# EAGLE design d200_zm1020_rev_b (EAGLE 6.1)
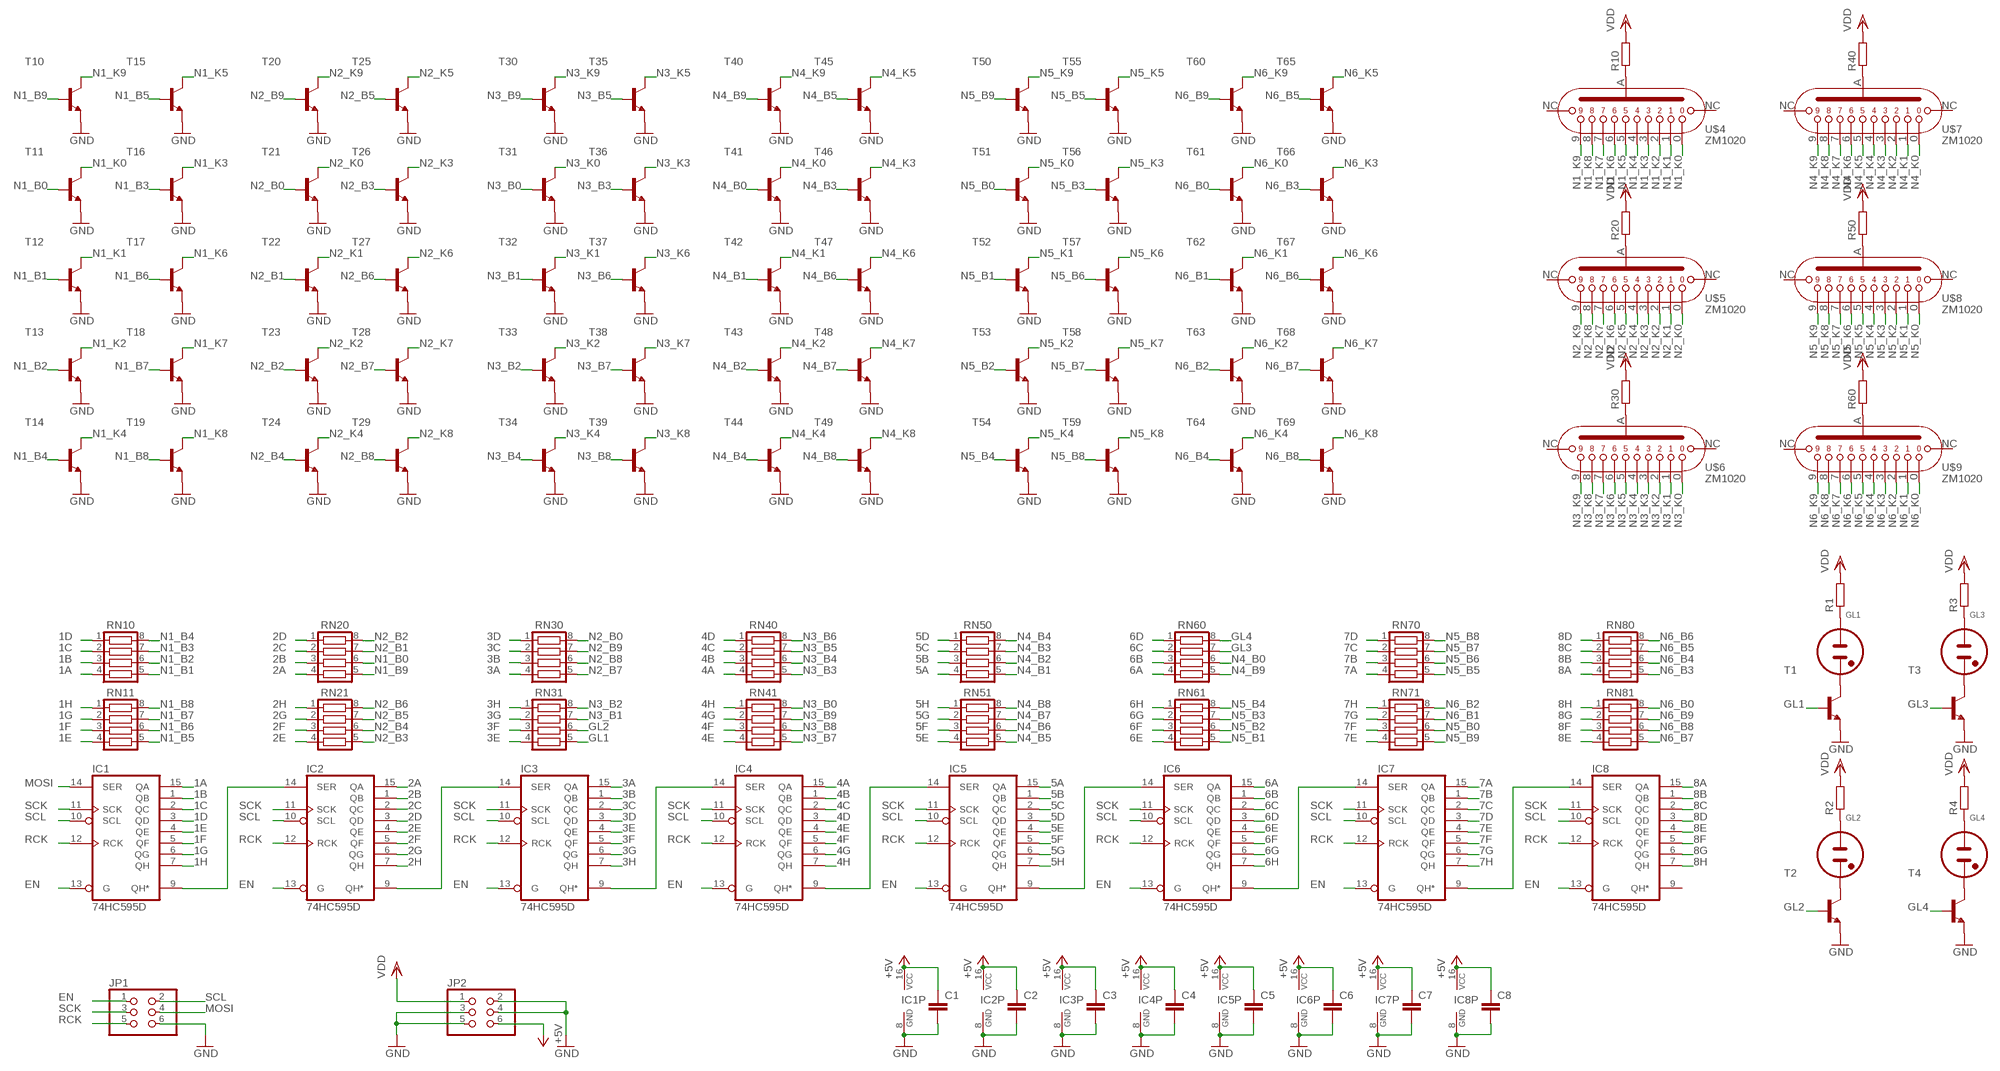
[diagram p0: schematic, sheet 1]

## Parts
C1  C-EUC0603  [C0603]
C2  C-EUC0603  [C0603]
C3  C-EUC0603  [C0603]
C4  C-EUC0603  [C0603]
C5  C-EUC0603  [C0603]
C6  C-EUC0603  [C0603]
C7  C-EUC0603  [C0603]
C8  C-EUC0603  [C0603]
GL1  NE2-NEON-BULB-DRILL  [NE2-NEON-BULB-DRILL]
GL2  NE2-NEON-BULB-DRILL  [NE2-NEON-BULB-DRILL]
GL3  NE2-NEON-BULB-DRILL  [NE2-NEON-BULB-DRILL]
GL4  NE2-NEON-BULB-DRILL  [NE2-NEON-BULB-DRILL]
IC1  74HC595D  [SO16]
IC2  74HC595D  [SO16]
IC3  74HC595D  [SO16]
IC4  74HC595D  [SO16]
IC5  74HC595D  [SO16]
IC6  74HC595D  [SO16]
IC7  74HC595D  [SO16]
IC8  74HC595D  [SO16]
JP1  PINHD-2X3_2.54-SMD  [2X03SMD]
JP2  PINHD-2X3_2.54-SMD  [2X03SMD]
R1  R-EU_R0603  [R0603]
R2  R-EU_R0603  [R0603]
R3  R-EU_R0603  [R0603]
R4  R-EU_R0603  [R0603]
R10  R-EU_R0603  [R0603]
R20  R-EU_R0603  [R0603]
R30  R-EU_R0603  [R0603]
R40  R-EU_R0603  [R0603]
R50  R-EU_R0603  [R0603]
R60  R-EU_R0603  [R0603]
RN10  CTS742C083  [CTS742C083]
RN11  CTS742C083  [CTS742C083]
RN20  CTS742C083  [CTS742C083]
RN21  CTS742C083  [CTS742C083]
RN30  CTS742C083  [CTS742C083]
RN31  CTS742C083  [CTS742C083]
RN40  CTS742C083  [CTS742C083]
RN41  CTS742C083  [CTS742C083]
RN50  CTS742C083  [CTS742C083]
RN51  CTS742C083  [CTS742C083]
RN60  CTS742C083  [CTS742C083]
RN61  CTS742C083  [CTS742C083]
RN70  CTS742C083  [CTS742C083]
RN71  CTS742C083  [CTS742C083]
RN80  CTS742C083  [CTS742C083]
RN81  CTS742C083  [CTS742C083]
T1  SMBTA42  [SOT23]
T2  SMBTA42  [SOT23]
T3  SMBTA42  [SOT23]
T4  SMBTA42  [SOT23]
T10  SMBTA42  [SOT23]
T11  SMBTA42  [SOT23]
T12  SMBTA42  [SOT23]
T13  SMBTA42  [SOT23]
T14  SMBTA42  [SOT23]
T15  SMBTA42  [SOT23]
T16  SMBTA42  [SOT23]
T17  SMBTA42  [SOT23]
T18  SMBTA42  [SOT23]
T19  SMBTA42  [SOT23]
T20  SMBTA42  [SOT23]
T21  SMBTA42  [SOT23]
T22  SMBTA42  [SOT23]
T23  SMBTA42  [SOT23]
T24  SMBTA42  [SOT23]
T25  SMBTA42  [SOT23]
T26  SMBTA42  [SOT23]
T27  SMBTA42  [SOT23]
T28  SMBTA42  [SOT23]
T29  SMBTA42  [SOT23]
T30  SMBTA42  [SOT23]
T31  SMBTA42  [SOT23]
T32  SMBTA42  [SOT23]
T33  SMBTA42  [SOT23]
T34  SMBTA42  [SOT23]
T35  SMBTA42  [SOT23]
T36  SMBTA42  [SOT23]
T37  SMBTA42  [SOT23]
T38  SMBTA42  [SOT23]
T39  SMBTA42  [SOT23]
T40  SMBTA42  [SOT23]
T41  SMBTA42  [SOT23]
T42  SMBTA42  [SOT23]
T43  SMBTA42  [SOT23]
T44  SMBTA42  [SOT23]
T45  SMBTA42  [SOT23]
T46  SMBTA42  [SOT23]
T47  SMBTA42  [SOT23]
T48  SMBTA42  [SOT23]
T49  SMBTA42  [SOT23]
T50  SMBTA42  [SOT23]
T51  SMBTA42  [SOT23]
T52  SMBTA42  [SOT23]
T53  SMBTA42  [SOT23]
T54  SMBTA42  [SOT23]
T55  SMBTA42  [SOT23]
T56  SMBTA42  [SOT23]
T57  SMBTA42  [SOT23]
T58  SMBTA42  [SOT23]
T59  SMBTA42  [SOT23]
T60  SMBTA42  [SOT23]
T61  SMBTA42  [SOT23]
T62  SMBTA42  [SOT23]
T63  SMBTA42  [SOT23]
T64  SMBTA42  [SOT23]
T65  SMBTA42  [SOT23]
T66  SMBTA42  [SOT23]
T67  SMBTA42  [SOT23]
T68  SMBTA42  [SOT23]
T69  SMBTA42  [SOT23]
U$4  ZM1020  [ZM1020]
U$5  ZM1020  [ZM1020]
U$6  ZM1020  [ZM1020]
U$7  ZM1020  [ZM1020]
U$8  ZM1020  [ZM1020]
U$9  ZM1020  [ZM1020]

## Nets
1A: IC1.15(QA) RN10.4
1B: IC1.1(QB) RN10.3
1C: IC1.2(QC) RN10.2
1D: IC1.3(QD) RN10.1
1E: IC1.4(QE) RN11.4
1F: IC1.5(QF) RN11.3
1G: IC1.6(QG) RN11.2
1H: IC1.7(QH) RN11.1
2A: IC2.15(QA) RN20.4
2B: IC2.1(QB) RN20.3
2C: IC2.2(QC) RN20.2
2D: IC2.3(QD) RN20.1
2E: IC2.4(QE) RN21.4
2F: IC2.5(QF) RN21.3
2G: IC2.6(QG) RN21.2
2H: IC2.7(QH) RN21.1
3A: IC3.15(QA) RN30.4
3B: IC3.1(QB) RN30.3
3C: IC3.2(QC) RN30.2
3D: IC3.3(QD) RN30.1
3E: IC3.4(QE) RN31.4
3F: IC3.5(QF) RN31.3
3G: IC3.6(QG) RN31.2
3H: IC3.7(QH) RN31.1
4A: IC4.15(QA) RN40.4
4B: IC4.1(QB) RN40.3
4C: IC4.2(QC) RN40.2
4D: IC4.3(QD) RN40.1
4E: IC4.4(QE) RN41.4
4F: IC4.5(QF) RN41.3
4G: IC4.6(QG) RN41.2
4H: IC4.7(QH) RN41.1
5A: IC5.15(QA) RN50.4
5B: IC5.1(QB) RN50.3
5C: IC5.2(QC) RN50.2
5D: IC5.3(QD) RN50.1
5E: IC5.4(QE) RN51.4
5F: IC5.5(QF) RN51.3
5G: IC5.6(QG) RN51.2
5H: IC5.7(QH) RN51.1
6A: IC6.15(QA) RN60.4
6B: IC6.1(QB) RN60.3
6C: IC6.2(QC) RN60.2
6D: IC6.3(QD) RN60.1
6E: IC6.4(QE) RN61.4
6F: IC6.5(QF) RN61.3
6G: IC6.6(QG) RN61.2
6H: IC6.7(QH) RN61.1
7A: IC7.15(QA) RN70.4
7B: IC7.1(QB) RN70.3
7C: IC7.2(QC) RN70.2
7D: IC7.3(QD) RN70.1
7E: IC7.4(QE) RN71.4
7F: IC7.5(QF) RN71.3
7G: IC7.6(QG) RN71.2
7H: IC7.7(QH) RN71.1
8A: IC8.15(QA) RN80.4
8B: IC8.1(QB) RN80.3
8C: IC8.2(QC) RN80.2
8D: IC8.3(QD) RN80.1
8E: IC8.4(QE) RN81.4
8F: IC8.5(QF) RN81.3
8G: IC8.6(QG) RN81.2
8H: IC8.7(QH) RN81.1
+5V: C1.1 C2.1 C3.1 C4.1 C5.1 C6.1 C7.1 C8.1 IC1.16(VCC) IC2.16(VCC) IC3.16(VCC) IC4.16(VCC) IC5.16(VCC) IC6.16(VCC) IC7.16(VCC) IC8.16(VCC) JP2.6
EN: IC1.13(G) IC2.13(G) IC3.13(G) IC4.13(G) IC5.13(G) IC6.13(G) IC7.13(G) IC8.13(G) JP1.1
GL1: RN31.5 T1.1(B)
GL2: RN31.6 T2.1(B)
GL3: RN60.7 T3.1(B)
GL4: RN60.8 T4.1(B)
GND: C1.2 C2.2 C3.2 C4.2 C5.2 C6.2 C7.2 C8.2 IC1.8(GND) IC2.8(GND) IC3.8(GND) IC4.8(GND) IC5.8(GND) IC6.8(GND) IC7.8(GND) IC8.8(GND) JP1.6 JP2.2 JP2.3 JP2.4 JP2.5 T1.2(E) T2.2(E) T3.2(E) T4.2(E) T10.2(E) T11.2(E) T12.2(E) T13.2(E) T14.2(E) T15.2(E) T16.2(E) T17.2(E) T18.2(E) T19.2(E) T20.2(E) T21.2(E) T22.2(E) T23.2(E) T24.2(E) T25.2(E) T26.2(E) T27.2(E) T28.2(E) T29.2(E) T30.2(E) T31.2(E) T32.2(E) T33.2(E) T34.2(E) T35.2(E) T36.2(E) T37.2(E) T38.2(E) T39.2(E) T40.2(E) T41.2(E) T42.2(E) T43.2(E) T44.2(E) T45.2(E) T46.2(E) T47.2(E) T48.2(E) T49.2(E) T50.2(E) T51.2(E) T52.2(E) T53.2(E) T54.2(E) T55.2(E) T56.2(E) T57.2(E) T58.2(E) T59.2(E) T60.2(E) T61.2(E) T62.2(E) T63.2(E) T64.2(E) T65.2(E) T66.2(E) T67.2(E) T68.2(E) T69.2(E)
MOSI: IC1.14(SER) JP1.4
N1_B0: RN20.6 T11.1(B)
N1_B1: RN10.5 T12.1(B)
N1_B2: RN10.6 T13.1(B)
N1_B3: RN10.7 T16.1(B)
N1_B4: RN10.8 T14.1(B)
N1_B5: RN11.5 T15.1(B)
N1_B6: RN11.6 T17.1(B)
N1_B7: RN11.7 T18.1(B)
N1_B8: RN11.8 T19.1(B)
N1_B9: RN20.5 T10.1(B)
N1_K0: T11.3(C) U$4.P3
N1_K1: T12.3(C) U$4.P13
N1_K2: T13.3(C) U$4.P12
N1_K3: T16.3(C) U$4.P11
N1_K4: T14.3(C) U$4.P10
N1_K5: T15.3(C) U$4.P9
N1_K6: T17.3(C) U$4.P7
N1_K7: T18.3(C) U$4.P6
N1_K8: T19.3(C) U$4.P5
N1_K9: T10.3(C) U$4.P4
N2_B0: RN30.8 T21.1(B)
N2_B1: RN20.7 T22.1(B)
N2_B2: RN20.8 T23.1(B)
N2_B3: RN21.5 T26.1(B)
N2_B4: RN21.6 T24.1(B)
N2_B5: RN21.7 T25.1(B)
N2_B6: RN21.8 T27.1(B)
N2_B7: RN30.5 T28.1(B)
N2_B8: RN30.6 T29.1(B)
N2_B9: RN30.7 T20.1(B)
N2_K0: T21.3(C) U$5.P3
N2_K1: T22.3(C) U$5.P13
N2_K2: T23.3(C) U$5.P12
N2_K3: T26.3(C) U$5.P11
N2_K4: T24.3(C) U$5.P10
N2_K5: T25.3(C) U$5.P9
N2_K6: T27.3(C) U$5.P7
N2_K7: T28.3(C) U$5.P6
N2_K8: T29.3(C) U$5.P5
N2_K9: T20.3(C) U$5.P4
N3_B0: RN41.8 T31.1(B)
N3_B1: RN31.7 T32.1(B)
N3_B2: RN31.8 T33.1(B)
N3_B3: RN40.5 T36.1(B)
N3_B4: RN40.6 T34.1(B)
N3_B5: RN40.7 T35.1(B)
N3_B6: RN40.8 T37.1(B)
N3_B7: RN41.5 T38.1(B)
N3_B8: RN41.6 T39.1(B)
N3_B9: RN41.7 T30.1(B)
N3_K0: T31.3(C) U$6.P3
N3_K1: T32.3(C) U$6.P13
N3_K2: T33.3(C) U$6.P12
N3_K3: T36.3(C) U$6.P11
N3_K4: T34.3(C) U$6.P10
N3_K5: T35.3(C) U$6.P9
N3_K6: T37.3(C) U$6.P7
N3_K7: T38.3(C) U$6.P6
N3_K8: T39.3(C) U$6.P5
N3_K9: T30.3(C) U$6.P4
N4_B0: RN60.6 T41.1(B)
N4_B1: RN50.5 T42.1(B)
N4_B2: RN50.6 T43.1(B)
N4_B3: RN50.7 T46.1(B)
N4_B4: RN50.8 T44.1(B)
N4_B5: RN51.5 T45.1(B)
N4_B6: RN51.6 T47.1(B)
N4_B7: RN51.7 T48.1(B)
N4_B8: RN51.8 T49.1(B)
N4_B9: RN60.5 T40.1(B)
N4_K0: T41.3(C) U$7.P3
N4_K1: T42.3(C) U$7.P13
N4_K2: T43.3(C) U$7.P12
N4_K3: T46.3(C) U$7.P11
N4_K4: T44.3(C) U$7.P10
N4_K5: T45.3(C) U$7.P9
N4_K6: T47.3(C) U$7.P7
N4_K7: T48.3(C) U$7.P6
N4_K8: T49.3(C) U$7.P5
N4_K9: T40.3(C) U$7.P4
N5_B0: RN71.6 T51.1(B)
N5_B1: RN61.5 T52.1(B)
N5_B2: RN61.6 T53.1(B)
N5_B3: RN61.7 T56.1(B)
N5_B4: RN61.8 T54.1(B)
N5_B5: RN70.5 T55.1(B)
N5_B6: RN70.6 T57.1(B)
N5_B7: RN70.7 T58.1(B)
N5_B8: RN70.8 T59.1(B)
N5_B9: RN71.5 T50.1(B)
N5_K0: T51.3(C) U$8.P3
N5_K1: T52.3(C) U$8.P13
N5_K2: T53.3(C) U$8.P12
N5_K3: T56.3(C) U$8.P11
N5_K4: T54.3(C) U$8.P10
N5_K5: T55.3(C) U$8.P9
N5_K6: T57.3(C) U$8.P7
N5_K7: T58.3(C) U$8.P6
N5_K8: T59.3(C) U$8.P5
N5_K9: T50.3(C) U$8.P4
N6_B0: RN81.8 T61.1(B)
N6_B1: RN71.7 T62.1(B)
N6_B2: RN71.8 T63.1(B)
N6_B3: RN80.5 T66.1(B)
N6_B4: RN80.6 T64.1(B)
N6_B5: RN80.7 T65.1(B)
N6_B6: RN80.8 T67.1(B)
N6_B7: RN81.5 T68.1(B)
N6_B8: RN81.6 T69.1(B)
N6_B9: RN81.7 T60.1(B)
N6_K0: T61.3(C) U$9.P3
N6_K1: T62.3(C) U$9.P13
N6_K2: T63.3(C) U$9.P12
N6_K3: T66.3(C) U$9.P11
N6_K4: T64.3(C) U$9.P10
N6_K5: T65.3(C) U$9.P9
N6_K6: T67.3(C) U$9.P7
N6_K7: T68.3(C) U$9.P6
N6_K8: T69.3(C) U$9.P5
N6_K9: T60.3(C) U$9.P4
N$1: GL2.1(A) R2.1
N$2: GL3.1(A) R3.1
N$3: GL4.1(A) R4.1
N$4: R10.1 U$4.P2(A)
N$5: GL2.2(A1) T2.3(C)
N$6: GL1.2(A1) T1.3(C)
N$7: GL4.2(A1) T4.3(C)
N$8: GL3.2(A1) T3.3(C)
N$9: R20.1 U$5.P2(A)
N$10: IC1.9(QH*) IC2.14(SER)
N$11: IC2.9(QH*) IC3.14(SER)
N$12: IC3.9(QH*) IC4.14(SER)
N$13: R30.1 U$6.P2(A)
N$14: R40.1 U$7.P2(A)
N$15: R50.1 U$8.P2(A)
N$16: IC4.9(QH*) IC5.14(SER)
N$17: R60.1 U$9.P2(A)
N$18: IC5.9(QH*) IC6.14(SER)
N$19: IC6.9(QH*) IC7.14(SER)
N$20: IC7.9(QH*) IC8.14(SER)
N$21: GL1.1(A) R1.1
RCK: IC1.12(RCK) IC2.12(RCK) IC3.12(RCK) IC4.12(RCK) IC5.12(RCK) IC6.12(RCK) IC7.12(RCK) IC8.12(RCK) JP1.5
SCK: IC1.11(SCK) IC2.11(SCK) IC3.11(SCK) IC4.11(SCK) IC5.11(SCK) IC6.11(SCK) IC7.11(SCK) IC8.11(SCK) JP1.3
SCL: IC1.10(SCL) IC2.10(SCL) IC3.10(SCL) IC4.10(SCL) IC5.10(SCL) IC6.10(SCL) IC7.10(SCL) IC8.10(SCL) JP1.2
VDD: JP2.1 R1.2 R2.2 R3.2 R4.2 R10.2 R20.2 R30.2 R40.2 R50.2 R60.2
Unconnected: IC8.9(QH*) U$4.P1(NC1) U$4.P8(NC2) U$5.P1(NC1) U$5.P8(NC2) U$6.P1(NC1) U$6.P8(NC2) U$7.P1(NC1) U$7.P8(NC2) U$8.P1(NC1) U$8.P8(NC2) U$9.P1(NC1) U$9.P8(NC2)

## Library data of the parts
C1-C8 = rcl:C-EU: CAPACITOR, European symbol
GL1-GL4 = nixie_tube:NE2-NEON-BULB: Neon indicator (wire connection)
IC1-IC8 = 74xx-eu:74*595: 8-bit SHIFT REGISTER, output latch
JP1 JP2 = con-pinhead:PINHD-2X3: PIN HEADER
R1-R4 R10 R20 R30 R40 R50 R60 = rcl:R-EU_: RESISTOR, European symbol
RN10 RN11 RN20 RN21 RN30 RN31 RN40 RN41 RN50 RN51 RN60 RN61 RN70 RN71 RN80 RN81 = resistor-net:CTS742C083: Chip Resistor Array 4 Single Resistor Source: http://www.ctscorp.com/components/Datasheets/CTSChipArrayDs.pdf; OC_FARNELL: unknown; OC_NEWARK: unknown
T1-T4 T10-T69 = transistor-hv:SMBTA42
U$4-U$9 = nixietubes-western:ZM1020

## Board
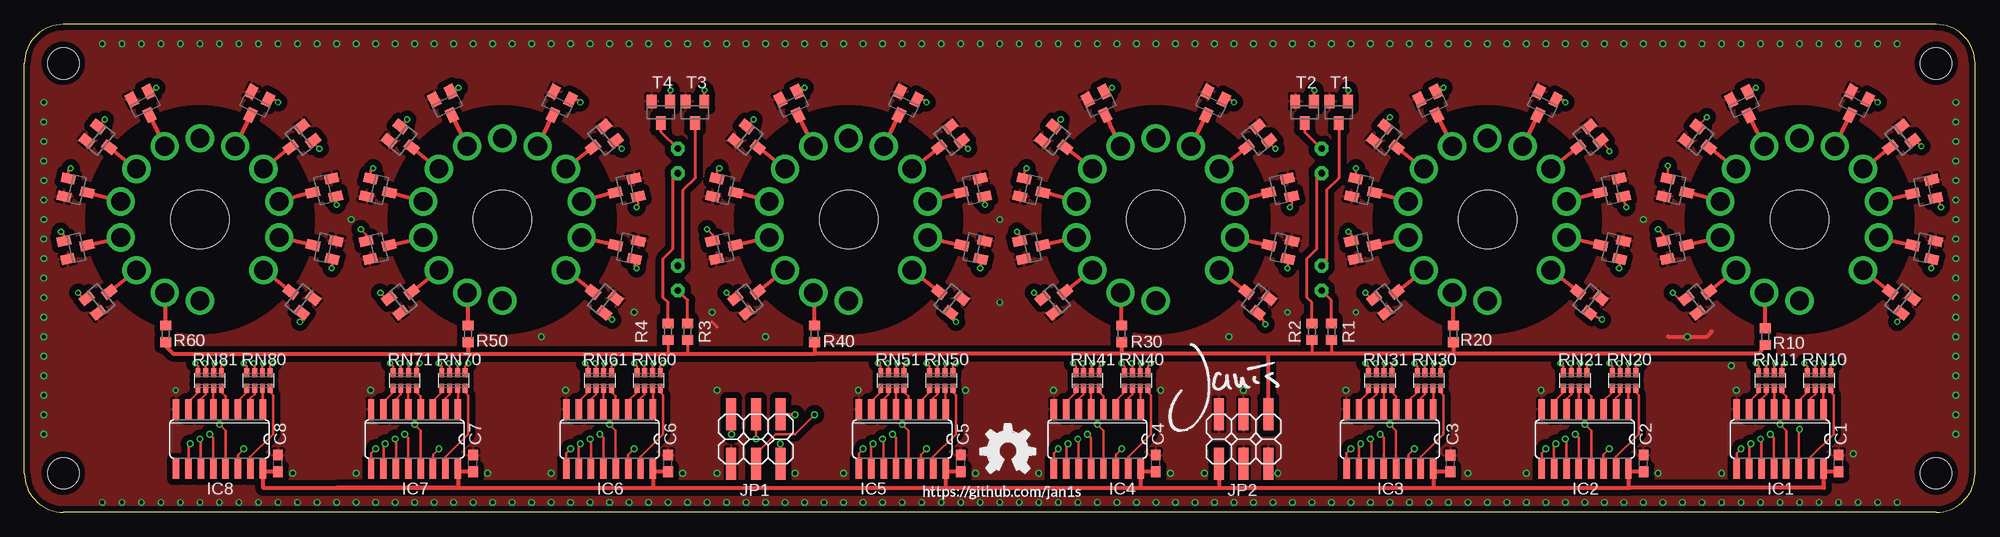
[diagram p1: board, top side]
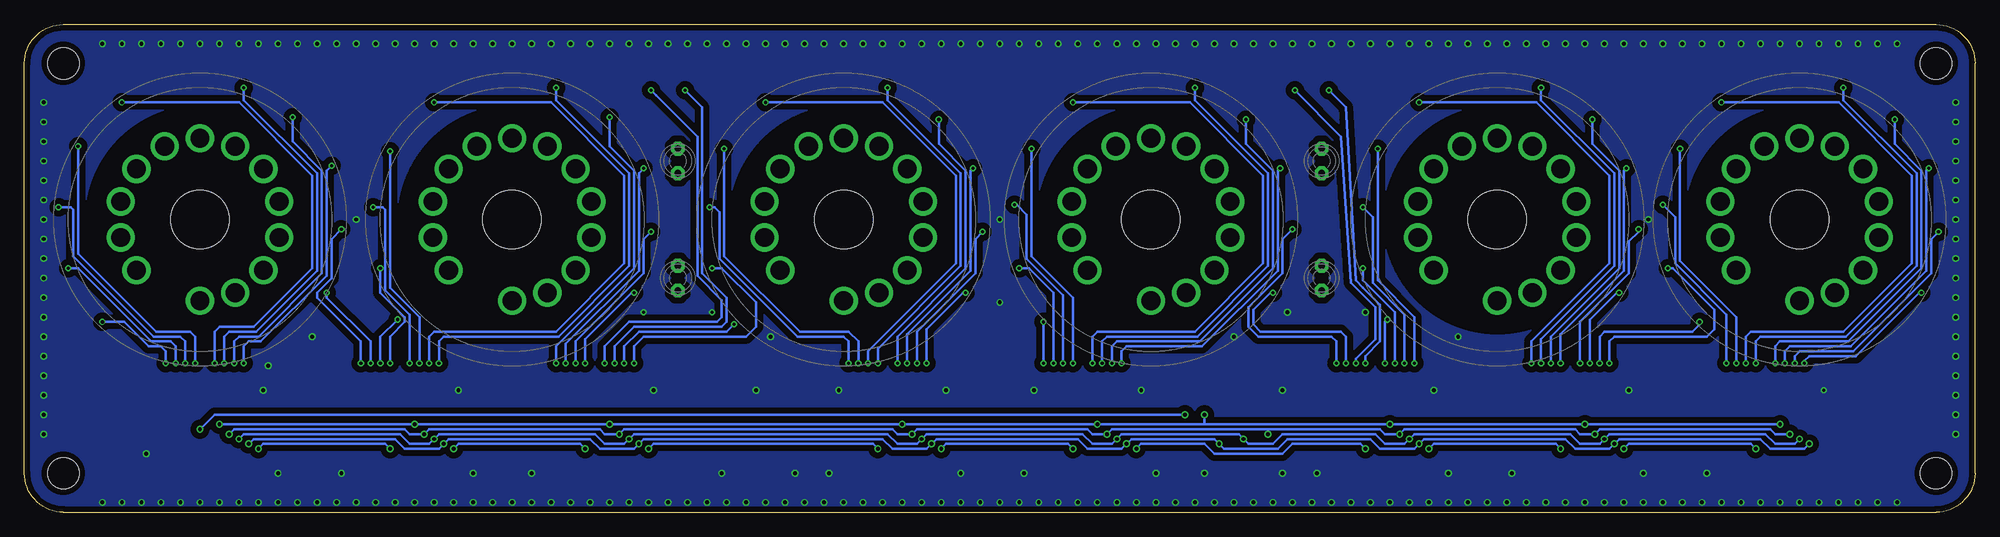
[diagram p2: board, bottom side, seen from below]

Size 200 x 50 mm. Coordinates in mm from the lower left corner, seen from the top.
Outline: 196,0 4,0 arc-90 0,4 0,46 arc-90 4,50 196,50 arc-90 200,46 200,4 arc-90 196,0
Copper layers (1*16): Top 0.035mm / dielectric 1.5mm / Bottom 0.035mm
Design rules: minimum track width 6mil, minimum drill 12mil, track to track 6mil, track to pad 6mil, pad to pad 6mil, via to via 6mil, smd to smd 0mil, copper to edge 10mil, drill to drill 10mil, minimum pad ring 10mil, minimum via ring 6mil, stop-mask expansion 2mil, vias tented up to drill 100mil, thermal gap 10mil
Holes 3.2 mm at 196,4 196,46 4,46 4,4
tRestrict: area 171,19 to 193,41; area 139,19 to 161,41; area 105,19 to 127,41; area 73.5,19 to 95.5,41; area 38,19 to 60,41; area 7,19 to 29,41
bRestrict: area 171,19 to 193,41; area 139,19 to 161,41; area 105,19 to 127,41; area 73.5,19 to 95.5,41; area 38,19 to 60,41; area 7,19 to 29,41

### Footprints (pad centres in the part's own frame; a part is rotated, then mirrored left to right if it is on the bottom)
C0603 = smd 1.1 x 1: 1 -0.85,0; 2 0.85,0
NE2-NEON-BULB-DRILL = drill 0.7 pad 1.422 octagon: 1 0,1.27; 2 0,-1.27
SO16 = smd 0.66 x 2.032: 1 -4.445,-3.073; 2 -3.175,-3.073; 3 -1.905,-3.073; 4 -0.635,-3.073; 5 0.635,-3.073; 6 1.905,-3.073; 7 3.175,-3.073; 8 4.445,-3.073; 9 4.445,3.073; 10 3.175,3.073; 11 1.905,3.073; 12 0.635,3.073; 13 -0.635,3.073; 14 -1.905,3.073; 15 -3.175,3.073; 16 -4.445,3.073
2X03SMD = smd 1.016 x 3.302: 1 -2.54,-2.54; 2 -2.54,2.54; 3 0,-2.54; 4 0,2.54; 5 2.54,-2.54; 6 2.54,2.54
R0603 = smd 1 x 1.1: 1 -0.85,0; 2 0.85,0
CTS742C083 = smd 0.5 x 0.9: 1 -1.2,-0.8; 2 -0.4,-0.8; 3 0.4,-0.8; 4 1.2,-0.8; 5 1.2,0.8; 6 0.4,0.8; 7 -0.4,0.8; 8 -1.2,0.8
SOT23 = smd 1 x 1.4: 1 -0.95,-1.1; 2 0.95,-1.1; 3 0,1.1
ZM1020 = drill 1.93: P1 0,-8.325; P2 3.61,-7.5; P3 6.51,-5.19; P4 8.12,-1.85; P5 8.12,1.85; P6 6.51,5.19; P7 3.61,7.5; P8 0,8.325; P9 -3.61,7.5; P10 -6.51,5.19; P11 -8.12,1.85; P12 -8.12,-1.85; P13 -6.51,-5.19 | hole 6: 0,0

### Placement (x,y rotation side)
C1  186,5 90 top
C2  166,5 90 top
C3  146.2,4.99 90 top
C4  116,5 90 top
C5  96,5 90 top
C6  66,5 90 top
C7  46,5 90 top
C8  26,5 90 top
GL1  133,24 180 bottom
GL2  133,36 180 bottom
GL3  67,24 180 bottom
GL4  67,36 180 bottom
IC1  180,7.5 180 top
IC2  160,7.5 180 top
IC3  140,7.5 180 top
IC4  110,7.5 180 top
IC5  90,7.5 180 top
IC6  60,7.5 180 top
IC7  40,7.5 180 top
IC8  20,7.5 180 top
JP1  75,7.5 180 top
JP2  125,7.5 180 top
R1  134,18.5 270 top
R2  132,18.5 270 top
R3  68,18.5 270 top
R4  66,18.5 270 top
R10  178.5,18 270 top
R20  146.5,18.28 270 top
R30  112.5,18.28 270 top
R40  81,18.28 270 top
R50  45.5,18.28 270 top
R60  14.5,18.28 270 top
RN10  184,13.5 0 top
RN11  179,13.5 0 top
RN20  164,13.5 0 top
RN21  159,13.5 0 top
RN30  144,13.5 0 top
RN31  139,13.5 0 top
RN40  114,13.5 0 top
RN41  109,13.5 0 top
RN50  94,13.5 0 top
RN51  89,13.5 0 top
RN60  64,13.5 0 top
RN61  59,13.5 0 top
RN70  44,13.5 0 top
RN71  39,13.5 0 top
RN80  24,13.5 0 top
RN81  19,13.5 0 top
T1  134.75,41 180 top
T2  131.25,41 180 top
T3  68.75,41 180 top
T4  65.25,41 180 top
T10  169.32,27.12 282.8 top
T11  171.84,21.89 308.6 top
T12  192.16,21.89 51.4 top
T13  194.68,27.12 77.2 top
T14  192.16,38.11 128.6 top
T15  187.66,41.7 154.2 top
T16  194.67,32.9 102.9 top
T17  176.32,41.66 205.8 top
T18  171.83,38.1 231.4 top
T19  169.36,33.03 256.5 top
T20  137.32,27.12 282.8 top
T21  139.84,21.89 308.6 top
T22  160.16,21.89 51.4 top
T23  162.68,27.12 77.2 top
T24  160.16,38.11 128.6 top
T25  155.66,41.7 154.2 top
T26  162.64,33.03 103.5 top
T27  144.34,41.7 205.8 top
T28  139.84,38.11 231.4 top
T29  137.36,33.03 256.5 top
T30  103.32,27.12 282.8 top
T31  105.84,21.89 308.6 top
T32  126.16,21.89 51.4 top
T33  128.68,27.12 77.2 top
T34  126.16,38.11 128.6 top
T35  121.66,41.7 154.2 top
T36  128.64,33.03 103.5 top
T37  110.34,41.7 205.8 top
T38  105.84,38.11 231.4 top
T39  103.36,33.03 256.5 top
T40  71.82,27.12 282.8 top
T41  74.34,21.89 308.6 top
T42  94.66,21.89 51.4 top
T43  97.18,27.12 77.2 top
T44  94.66,38.11 128.6 top
T45  90.16,41.7 154.2 top
T46  97.14,33.03 103.5 top
T47  78.84,41.7 205.8 top
T48  74.34,38.11 231.4 top
T49  71.86,33.03 256.5 top
T50  36.32,27.12 282.8 top
T51  38.84,21.89 308.6 top
T52  59.16,21.89 51.4 top
T53  61.68,27.12 77.2 top
T54  59.16,38.11 128.6 top
T55  54.66,41.7 154.2 top
T56  61.64,33.03 103.5 top
T57  43.34,41.7 205.8 top
T58  38.84,38.11 231.4 top
T59  36.36,33.03 256.5 top
T60  5.32,27.12 282.8 top
T61  7.84,21.89 308.6 top
T62  28.16,21.89 51.4 top
T63  30.68,27.12 77.2 top
T64  28.16,38.11 128.6 top
T65  23.66,41.7 154.2 top
T66  30.64,33.03 103.5 top
T67  12.34,41.7 205.8 top
T68  7.84,38.11 231.4 top
T69  5.36,33.03 256.5 top
U$1  [OSHW_FILLX200_NOTEXT]  98,4 0 top
U$2  [JANIS_10MM]  117,8 0 top
U$3  [GITHUB/JAN1S]  92,1.5 0 top
U$4  182,30 0 bottom
U$5  150,30 0 bottom
U$6  116,30 0 bottom
U$7  84.5,30 0 bottom
U$8  49,30 0 bottom
U$9  18,30 0 bottom

### Tracks (layer width: path | path; a pad name or v marks a point on that pad's centre or on a via)
1A
  Top 0.254: RN10.4 185.2,12.3 185.5,12 185.5,8 183.18,5.67 IC1.15
1B
  Top 0.254: IC1.1 184.44,12.65 RN10.3
1C
  Top 0.254: RN10.2 183.6,12.1 183.18,11.68 IC1.2
1D
  Top 0.254: RN10.1 182.8,12.3 181.91,11.4 IC1.3
1E
  Top 0.254: RN11.4 180.2,12.3 180.63,11.87 IC1.4
1F
  Top 0.254: RN11.3 179.4,10.61 IC1.5
1G
  Top 0.254: RN11.2 178.6,12.1 178.09,11.6 IC1.6
1H
  Top 0.254: RN11.1 177.8,12.3 176.82,11.32 IC1.7
2A
  Top 0.254: RN20.4 165.2,12.3 165.5,12 165.5,8 163.18,5.67 IC2.15
2B
  Top 0.254: IC2.1 164.44,12.65 RN20.3
2C
  Top 0.254: RN20.2 163.6,12.1 163.18,11.68 IC2.2
2D
  Top 0.254: RN20.1 162.8,12.3 161.91,11.4 IC2.3
2E
  Top 0.254: RN21.4 160.2,12.3 160.63,11.87 IC2.4
2F
  Top 0.254: IC2.5 159.37,12.66 RN21.3
2G
  Top 0.254: RN21.2 158.6,12.1 158.09,11.6 IC2.6
2H
  Top 0.254: RN21.1 157.8,12.3 156.82,11.32 IC2.7
3A
  Top 0.254: RN30.4 145.2,12.3 145.5,12 145.5,8 143.18,5.67 IC3.15
3B
  Top 0.254: IC3.1 144.44,12.65 RN30.3
3C
  Top 0.254: RN30.2 143.6,12.1 143.18,11.68 IC3.2
3D
  Top 0.254: RN30.1 142.8,12.3 141.91,11.4 IC3.3
3E
  Top 0.254: RN31.4 140.2,12.3 140.63,11.87 IC3.4
3F
  Top 0.254: IC3.5 139.37,12.66 RN31.3
3G
  Top 0.254: IC3.6 138.09,11.6 138.6,12.1 RN31.2
3H
  Top 0.254: IC3.7 136.82,11.32 137.8,12.3 RN31.1
4A
  Top 0.254: RN40.4 115.2,12.3 115.5,12 115.5,8 113.17,5.67 IC4.15
4B
  Top 0.254: IC4.1 114.44,12.65 RN40.3
4C
  Top 0.254: RN40.2 113.6,12.1 113.17,11.68 IC4.2
4D
  Top 0.254: RN40.1 112.8,12.3 111.91,11.4 IC4.3
4E
  Top 0.254: RN41.4 110.2,12.3 110.64,11.87 IC4.4
4F
  Top 0.254: IC4.5 109.36,12.66 RN41.3
4G
  Top 0.254: IC4.6 108.09,11.6 108.6,12.1 RN41.2
4H
  Top 0.254: RN41.1 107.8,12.3 106.83,11.32 IC4.7
5A
  Top 0.254: RN50.4 95.2,12.3 95.5,12 95.5,8 93.17,5.67 IC5.15
5B
  Top 0.254: IC5.1 94.44,12.65 RN50.3
5C
  Top 0.254: IC5.2 93.17,11.68 93.6,12.1 RN50.2
5D
  Top 0.254: RN50.1 92.8,12.3 91.91,11.4 IC5.3
5E
  Top 0.254: RN51.4 90.2,12.3 90.64,11.87 IC5.4
5F
  Top 0.254: IC5.5 89.36,12.66 RN51.3
5G
  Top 0.254: IC5.6 88.09,11.6 88.6,12.1 RN51.2
5H
  Top 0.254: RN51.1 87.8,12.3 86.83,11.32 IC5.7
6A
  Top 0.254: RN60.4 65.2,12.3 65.5,12 65.5,8 63.17,5.67 IC6.15
6B
  Top 0.254: IC6.1 64.44,12.65 RN60.3
6C
  Top 0.254: IC6.2 63.17,11.68 63.6,12.1 RN60.2
6D
  Top 0.254: IC6.3 61.91,11.4 62.8,12.3 RN60.1
6E
  Top 0.254: IC6.4 60.63,11.87 60.2,12.3 RN61.4
6F
  Top 0.254: IC6.5 59.37,12.66 RN61.3
6G
  Top 0.254: IC6.6 58.09,11.6 58.6,12.1 RN61.2
6H
  Top 0.254: IC6.7 56.83,11.32 57.8,12.3 RN61.1
7A
  Top 0.254: RN70.4 45.2,12.3 45.5,12 45.5,8 43.17,5.67 IC7.15
7B
  Top 0.254: IC7.1 44.45,12.65 RN70.3
7C
  Top 0.254: IC7.2 43.17,11.68 43.6,12.1 RN70.2
7D
  Top 0.254: IC7.3 41.91,11.4 42.8,12.3 RN70.1
7E
  Top 0.254: IC7.4 40.63,11.87 40.2,12.3 RN71.4
7F
  Top 0.254: IC7.5 39.37,12.66 RN71.3
7G
  Top 0.254: RN71.2 38.6,12.1 38.09,11.6 IC7.6
7H
  Top 0.254: RN71.1 37.8,12.3 36.83,11.32 IC7.7
8A
  Top 0.254: RN80.4 25.2,12.3 25.5,12 25.5,8 23.18,5.67 IC8.15
8B
  Top 0.254: IC8.1 24.45,12.65 RN80.3
8C
  Top 0.254: IC8.2 23.18,11.68 23.6,12.1 RN80.2
8D
  Top 0.254: IC8.3 21.91,11.4 22.8,12.3 RN80.1
8E
  Top 0.254: IC8.4 20.64,11.87 20.2,12.3 RN81.4
8F
  Top 0.254: IC8.5 19.36,12.66 RN81.3
8G
  Top 0.254: IC8.6 18.09,11.6 18.6,12.1 RN81.2
8H
  Top 0.254: IC8.7 16.82,11.32 17.8,12.3 RN81.1
+5V
  Top 0.406: 164.44,2.56 IC2.16 164.72,4.15 C2.1 | 164.44,2.56 164.5,2.5 184.5,2.5 184.44,2.56 IC1.16 184.72,4.15 C1.1 | 144.44,2.56 IC3.16 144.73,4.14 C3.1 | 144.44,2.56 144.5,2.5 164.39,2.5 164.44,2.56 | 114.44,2.56 IC4.16 114.72,4.15 C4.1 | 114.44,2.56 114.5,2.5 122.5,2.5 | 122.5,2.5 144.39,2.5 144.44,2.56 | JP2.6 122.46,2.54 122.5,2.5 | 94.5,2.5 94.44,2.56 IC5.16 94.72,4.15 C5.1 | 94.5,2.5 114.39,2.5 114.44,2.56 | 64.5,2.5 64.44,2.56 IC6.16 64.72,4.15 C6.1 | 64.5,2.5 94.5,2.5 | 44.45,2.56 IC7.16 44.72,4.15 C7.1 | 44.45,2.56 32,2.5 64.5,2.5 | 44.45,2.56 31.89,2.5 24.5,2.5 24.45,2.56 IC8.16 24.72,4.15 C8.1
EN  (via drill 0.4)
  Top 0.254: IC1.13 180.63,8.37 v180,9 | IC2.13 160.63,8.37 v160,9 | IC3.13 140.63,8.37 v140,9 | IC4.13 110.64,8.37 v110,9 | IC5.13 90.64,8.37 v90,9 | IC6.13 60.63,8.37 v60,9 | IC7.13 40.63,8.37 v40,9 | IC8.13 20.64,8.37 v20,9 | v79,10 77.58,10 JP1.1 78.96,10.04 v79,10
  Bottom 0.254: v180,9 v160,9 v140,9 v110,9 v90,9 79,9 | v79,10 79,9 | 79,9 v60,9 v40,9 v20,9
GL1  (via drill 0.32)
  Top 0.254: RN31.5 140.2,14.95 v140.5,15.25 | T1.1 135.7,43.2 v135.75,43.25
  Bottom 0.254: v140.5,15.25 140.5,17 138,19.5 129,19.5 128.5,20 128.5,21.75 131,24.25 131,38.5 135.25,42.75 v135.75,43.25
GL2  (via drill 0.32)
  Top 0.254: RN31.6 139.4,15.15 v139.5,15.25 | T2.1 132.2,43.2 v132.25,43.25
  Bottom 0.254: v139.5,15.25 139.5,17 137.5,19 128.5,19 128,19.5 128,22 130.5,24.5 130.5,41.5 v132.25,43.25
GL3  (via drill 0.32)
  Top 0.254: RN60.7 63.6,15.15 v63.5,15.25 | T3.1 69.7,43.2 v69.75,43.25
  Bottom 0.254: v63.5,15.25 63.5,15.75 61.5,17.75 61.5,21 64,23.5 65,38.5 v69.75,43.25
GL4  (via drill 0.32)
  Top 0.254: RN60.8 62.8,14.95 v62.5,15.25 | T4.1 66.2,43.2 v66.25,43.25
  Bottom 0.254: v62.5,15.25 62.5,16 61,17.5 61,21.25 62.75,23 63.5,23.75 64.5,41.5 v66.25,43.25
GND  (via drill 0.32, 0.4)
  Top 0.305: 71,19 70.5,19.5
  Top 0.406: 168.5,18 172.5,18 173,18.5
  other vias: 142,48 140,48 138,48 136,48 134,48 132,48 130,48 128,48 126,48 124,48 122,48 120,48 118,48 116,48 114,48 112,48 110,48 108,48 106,48 104,48 102,48 100,48 98,48 96,48 94,48 92,48 90,48 88,48 86,48 84,48 82,48 80,48 78,48 76,48 74,48 72,48 70,48 68,48 66,48 64,48 62,48 60,48 58,48 56,48 54,48 52,48 50,48 48,48 46,48 44,48 42,48 40,48 38,48 36,48 34,48 32,48 30,48 28,48 26,48 24,48 22,48 20,48 18,48 16,48 14,48 12,48 10,48 8,48 198,34 198,32 198,30 198,28 198,26 198,24 198,20 198,22 198,18 198,16 198,14 198,12 198,10 198,8 2,34 2,32 2,30 2,28 2,26 2,24 2,22 2,20 2,18 2,16 2,14 2,12 2,10 2,8 142,1 140,1 138,1 136,1 134,1 132,1 130,1 128,1 126,1 124,1 122,1 120,1 118,1 116,1 114,1 112,1 110,1 108,1 106,1 104,1 102,1 100,1 98,1 96,1 94,1 92,1 90,1 88,1 86,1 84,1 82,1 80,1 78,1 76,1 74,1 72,1 70,1 68,1 66,1 64,1 62,1 60,1 58,1 56,1 54,1 52,1 50,1 48,1 46,1 44,1 42,1 40,1 38,1 36,1 34,1 32,1 30,1 28,1 26,1 24,1 22,1 20,1 18,1 16,1 14,1 12,1 10,1 8,1 135.5,12.5 155.5,12.5 105.5,12.5 85.5,12.5 55.5,12.5 35.5,12.5 15.5,12.5 170.5,18 123.5,18 129.5,20.5 76,18 125,12.5 121,4 117.5,4 175.5,12.5 104,4 97.5,4 84,4 79,4 71,4 100,21.5 100,30 166,30 33.5,30 175,15 71,12.5 96.5,12.5 116.5,12.5 144,48 146,48 148,48 150,48 152,48 154,48 156,48 158,48 160,48 162,48 164,48 166,48 168,48 170,48 172,48 174,48 176,48 178,48 180,48 182,48 184,48 186,48 188,48 190,48 192,48 198,42 198,40 198,38 198,36 2,36 2,38 2,40 2,42 144,1 146,1 148,1 150,1 152,1 154,1 156,1 158,1 160,1 162,1 164,1 166,1 168,1 170,1 172,1 174,1 176,1 178,1 180,1 182,1 184,1 186,1 188,1 190,1 192,1 62.5,20.5 70.5,20.5 136.5,20.5 53,18 47.5,4 54,4 27.5,4 34,4 67.5,4 148,4 154,4 167.5,4 174,4 187.5,6 128.5,4
  pour Top (isolate 0.61): 197,0 200,3 200,47 197,50 3,50 0,47 0,3 3,0
  pour Bottom (isolate 0.61): 197,0 200,3 200,47 197,50 3,50 0,47 0,3 3,0
MOSI  (via drill 0.4)
  Top 0.254: IC1.14 181.91,8.4 v182,8.5 | JP1.4 75,6 77,8 79,8 v81,10
  Bottom 0.254: v182,8.5 180.5,10 v81,10
N1_B0  (via drill 0.32)
  Top 0.254: RN20.6 164.4,15.15 v164.5,15.25 | T11.1 169.55,21.95 v169,22.5
  Bottom 0.254: v169,22.5 169,22 164.5,17.5 v164.5,15.25
N1_B1  (via drill 0.32)
  Top 0.254: RN10.5 185.2,14.95 v185.5,15.25 | T12.1 192.68,20.18 v192,19.5
  Bottom 0.254: 185.5,15.5 v185.5,15.25 185.5,16.5 186,17 187.25,17 189.75,19.5 v192,19.5
N1_B2  (via drill 0.32)
  Top 0.254: RN10.6 184.4,15.15 v184.5,15.25 | T13.1 195.79,25.79 v195.5,25
  Bottom 0.254: v195.5,25 194.5,25 187,17.5 185,17.5 184.5,17 v184.5,15.25 184.5,15.5
N1_B3  (via drill 0.32)
  Top 0.254: RN10.7 183.6,15.15 v183.5,15.25 | T16.1 196.21,32.21 v196.5,31.25
  Bottom 0.254: 183.5,15.5 v183.5,15.25 183.5,17.5 184,18 186.75,18 195,26.25 195,31 195.25,31.25 v196.5,31.25
N1_B4  (via drill 0.32)
  Top 0.254: RN10.8 182.8,14.95 v182.5,15.25 | T14.1 193.61,38.39 v194.5,37.5
  Bottom 0.254: 182.5,15.5 v182.5,15.25 182.5,18 183,18.5 186.5,18.5 194.5,26.5 v194.5,37.5
N1_B5  (via drill 0.32)
  Top 0.254: RN11.5 180.2,14.95 v180.5,15.25 | T15.1 189.72,42.28 v190,42
  Bottom 0.254: 180.5,15.5 v180.5,15.25 180.5,18.5 180,19 176.5,19 170.5,25 170.5,34.5 178,42 v190,42
N1_B6  (via drill 0.32)
  Top 0.254: RN11.6 179.4,15.15 v179.5,15.25 | T17.1 177.06,43.06 v177.5,43.5
  Bottom 0.254: 179.5,15.5 v179.5,15.25 179.5,18 179,18.5 176.25,18.5 170,24.75 170,34.75 177.5,42.25 v177.5,43.5
N1_B7  (via drill 0.32)
  Top 0.254: RN11.7 178.6,15.15 v178.5,15.25 | T18.1 171.56,39.56 v172.5,40.5
  Bottom 0.254: 178.5,15.5 v178.5,15.25 178.5,17.5 178,18 176,18 169.5,24.5 169.5,35 172.5,38 v172.5,40.5
N1_B8  (via drill 0.32)
  Top 0.254: RN11.8 177.8,14.95 v177.5,15.25 | T19.1 168.51,35.49 v168.5,35.5
  Bottom 0.254: 177.5,15.5 v177.5,15.25 177.5,17 177,17.5 175.75,17.5 169,24.25 169,35 v168.5,35.5
N1_B9  (via drill 0.32)
  Top 0.254: RN20.5 165.2,14.95 v165.5,15.25 | T10.1 168.04,28.46 v167.5,29
  Bottom 0.254: 165.5,15.5 v165.5,15.25 165.5,17.5 170,22 170,22.5 168.5,24 168.5,28 v167.5,29
N1_K0
  Top 0.406: U$4.P3 T11.3
N1_K1
  Top 0.406: U$4.P13 T12.3
N1_K2
  Top 0.406: U$4.P12 T13.3
N1_K3
  Top 0.406: U$4.P11 T16.3
N1_K4
  Top 0.406: U$4.P10 T14.3
N1_K5
  Top 0.406: U$4.P9 T15.3
N1_K6
  Top 0.406: U$4.P7 T17.3
N1_K7
  Top 0.406: U$4.P6 T18.3
N1_K8
  Top 0.406: U$4.P5 T19.3
N1_K9
  Top 0.406: U$4.P4 T10.3
N2_B0  (via drill 0.32)
  Top 0.254: RN30.8 142.8,14.95 v142.5,15.25 | T21.1 138.05,21.95 v137.5,22.5
  Bottom 0.254: 142.5,15.5 v142.5,15.25 142.5,17.75 137.75,22.5 v137.5,22.5
N2_B1  (via drill 0.32)
  Top 0.254: RN20.7 163.6,15.15 v163.5,15.25 | T22.1 v161.75,19.75
  Bottom 0.254: 163.5,15.5 v163.5,15.25 163.5,18 v161.75,19.75
N2_B2  (via drill 0.32)
  Top 0.254: RN20.8 162.8,14.95 v162.5,15.25 | T23.1 163.54,25.04 v163.5,25
  Bottom 0.254: 162.5,15.5 v162.5,15.25 162.5,18 161,19.5 161,20 163.5,22.5 v163.5,25
N2_B3  (via drill 0.32)
  Top 0.254: RN21.5 160.2,14.95 v160.5,15.25 | T26.1 163.93,32.07 v164.25,31.25
  Bottom 0.254: 160.5,15.5 v160.5,15.25 160.5,20.25 163,22.75 163,31 163.25,31.25 v164.25,31.25
N2_B4  (via drill 0.32)
  Top 0.254: RN21.6 159.4,15.15 v159.5,15.25 | v162.5,37 162.5,37.17 T24.1
  Bottom 0.254: v159.5,15.25 159.5,20 162.5,23 v162.5,37
N2_B5  (via drill 0.32)
  Top 0.254: RN21.7 158.6,15.15 v158.5,15.25 | T25.1 157.72,42.28 v158,42
  Bottom 0.254: 158.5,15.5 v158.5,15.25 158.5,18 158,18.5 145.5,18.5 138.5,25.5 138.5,34.5 146,42 v158,42
N2_B6  (via drill 0.32)
  Top 0.254: RN21.8 157.8,14.95 v157.5,15.25 | T27.1 145.11,43.11 v145.5,43.5
  Bottom 0.254: 157.5,15.5 v157.5,15.25 157.5,17.5 157,18 145.25,18 138,25.25 138,34.75 145.5,42.25 v145.5,43.5
N2_B7  (via drill 0.32)
  Top 0.254: RN30.5 145.2,14.95 v145.5,15.25 | T28.1 139.57,40.07 v140,40.5
  Bottom 0.254: 145.5,15.5 v145.5,15.25 145.5,17 137.5,25 137.5,35 140,37.5 v140,40.5
N2_B8  (via drill 0.32)
  Top 0.254: RN30.6 144.4,15.15 v144.5,15.25 | T29.1 136.51,34.99 v136.5,35.25
  Bottom 0.254: 144.5,15.5 v144.5,15.25 144.5,17.25 137,24.75 137,34.75 v136.5,35.25
N2_B9  (via drill 0.32)
  Top 0.254: RN30.7 143.6,15.15 v143.5,15.25 | T20.1 136.04,28.46 v135.75,28.75
  Bottom 0.254: 143.5,15.5 v143.5,15.25 143.5,17.5 136.5,24.5 136.5,28 v135.75,28.75
N2_K0
  Top 0.406: T21.3 U$5.P3
N2_K1
  Top 0.406: T22.3 U$5.P13
N2_K2
  Top 0.406: T23.3 U$5.P12
N2_K3
  Top 0.406: T26.3 U$5.P11
N2_K4
  Top 0.406: T24.3 U$5.P10
N2_K5
  Top 0.406: T25.3 U$5.P9
N2_K6
  Top 0.406: T27.3 U$5.P7
N2_K7
  Top 0.406: T28.3 U$5.P6
N2_K8
  Top 0.406: T29.3 U$5.P5
N2_K9
  Top 0.406: T20.3 U$5.P4
N3_B0  (via drill 0.32)
  Top 0.254: RN41.8 107.8,14.95 v107.5,15.25 | T31.1 104.05,21.95 v103.5,22.5
  Bottom 0.254: 107.5,15.5 v107.5,15.25 107.5,18.75 103.75,22.5 v103.5,22.5
N3_B1  (via drill 0.32)
  Top 0.254: RN31.7 138.6,15.15 v138.5,15.25 | T32.1 126.54,20.46 v127.25,19.25
  Bottom 0.254: v127.25,19.25 128,18.5 137,18.5 138.5,17 v138.5,15.25
N3_B2  (via drill 0.32)
  Top 0.254: RN31.8 137.8,14.95 v137.5,15.25 | T33.1 129.54,25.04 v129.5,25
  Bottom 0.254: 137.5,16 v137.5,15.25 137.5,17 136.5,18 126,18 125,19 125,21.5 128.5,25 v129.5,25
N3_B3  (via drill 0.32)
  Top 0.254: T36.1 129.93,31.57 v129.75,31.25 | RN40.5 115.2,14.95 v115.5,15.25
  Bottom 0.254: v129.75,31.25 129.25,31.25 128.75,30.75 128.75,26 120.75,18 116,18 115.5,17.5 v115.5,15.25 115.5,16
N3_B4  (via drill 0.32)
  Top 0.254: RN40.6 114.4,15.15 v114.5,15.25 | T34.1 127.61,37.89 v128.25,37.25
  Bottom 0.254: v128.25,37.25 128.25,26.25 120.5,18.5 115.5,18.5 114.5,17.5 v114.5,15.25 114.5,16
N3_B5  (via drill 0.32)
  Top 0.254: RN40.7 113.6,15.15 v113.5,15.25 | T35.1 123.72,42.28 v124,42
  Bottom 0.254: v113.5,15.25 113.5,16.5 104.5,25.5 104.5,34.5 112,42 v124,42
N3_B6  (via drill 0.32)
  Top 0.254: RN40.8 112.8,14.95 v112.5,15.25 | T37.1 111.11,43.11 v111.5,43.5
  Bottom 0.254: v111.5,43.5 111.5,42.25 104,34.75 104,25.25 112.5,16.75 v112.5,15.25
N3_B7  (via drill 0.32)
  Top 0.254: RN41.5 110.2,14.95 v110.5,15.25 | T38.1 105.57,39.57 v106.25,40.25
  Bottom 0.254: 110.5,15.5 v110.5,15.25 110.5,18 103.5,25 103.5,35 106.25,37.75 v106.25,40.25
N3_B8  (via drill 0.32)
  Top 0.254: RN41.6 109.4,15.15 v109.5,15.25 | T39.1 102.51,35.01 v102.75,35.25
  Bottom 0.254: 109.5,15.5 v109.5,15.25 109.5,18.25 103,24.75 103,35 v102.75,35.25
N3_B9  (via drill 0.32)
  Top 0.254: RN41.7 108.6,15.15 v108.5,15.25 | T30.1 102.04,28.46 v101.75,28.75
  Bottom 0.254: 108.5,15.5 v108.5,15.25 108.5,18.5 102.5,24.5 102.5,28 v101.75,28.75
N3_K0
  Top 0.406: U$6.P3 T31.3
N3_K1
  Top 0.406: U$6.P13 T32.3
N3_K2
  Top 0.406: U$6.P12 T33.3
N3_K3
  Top 0.406: U$6.P11 T36.3
N3_K4
  Top 0.406: U$6.P10 T34.3
N3_K5
  Top 0.406: U$6.P9 T35.3
N3_K6
  Top 0.406: U$6.P7 T37.3
N3_K7
  Top 0.406: U$6.P6 T38.3
N3_K8
  Top 0.406: U$6.P5 T39.3
N3_K9
  Top 0.406: U$6.P4 T30.3
N4_B0  (via drill 0.32)
  Top 0.254: T41.1 72.55,21.95 v72,22.5 | RN60.6 64.4,15.15 v64.5,15.25
  Bottom 0.254: v72,22.5 72.25,22.5 74,20.75 74,19.25 73.25,18.5 65,18.5 64.5,18 v64.5,15.25
N4_B1  (via drill 0.32)
  Top 0.254: RN50.5 95.2,14.95 v95.5,15.25 | T42.1 95.04,20.46 v95.5,19.5
  Bottom 0.254: 95.5,15.5 v95.5,15.25 v95.5,19.5
N4_B2  (via drill 0.32)
  Top 0.254: RN50.6 94.4,15.15 v94.5,15.25 | T43.1 98.04,25.04 v98,25
  Bottom 0.254: 94.5,15.5 v94.5,15.25 94.5,22.5 97,25 v98,25
N4_B3  (via drill 0.32)
  Top 0.254: T46.1 98.43,31.57 v98.5,31.5 | RN50.7 93.6,15.15 v93.5,15.25
  Bottom 0.254: v98.5,31.5 98.25,31.5 97.25,30.5 97.25,26 93.5,22.25 v93.5,15.25
N4_B4  (via drill 0.32)
  Top 0.254: RN50.8 92.8,14.95 v92.5,15.25 | T44.1 96.11,37.89 v96.75,37.25
  Bottom 0.254: v96.75,37.25 96.75,26.25 92.5,22 v92.5,15.25
N4_B5  (via drill 0.32)
  Top 0.254: RN51.5 90.2,14.95 v90.5,15.25 | T45.1 92.22,42.28 v92.5,42
  Bottom 0.254: 90.5,15.5 v90.5,15.25 90.5,18 90,18.5 80,18.5 73,25.5 73,34.5 80.5,42 v92.5,42
N4_B6  (via drill 0.32)
  Top 0.254: RN51.6 89.4,15.15 v89.5,15.25 | T47.1 79.61,43.11 v80,43.5
  Bottom 0.254: v80,43.5 80,42.25 72.5,34.75 72.5,25.25 79.75,18 89,18 89.5,17.5 v89.5,15.25
N4_B7  (via drill 0.32)
  Top 0.254: T48.1 74.07,39.57 v74.75,40.25 | RN51.7 88.6,15.15 v88.5,15.25
  Bottom 0.254: v74.75,40.25 74.75,37.75 72,35 72,25 79.5,17.5 88,17.5 88.5,17 v88.5,15.25
N4_B8  (via drill 0.32)
  Top 0.254: RN51.8 87.8,14.95 v87.5,15.25 | T49.1 71.01,35.01 v71.25,35.25
  Bottom 0.254: v71.25,35.25 71.5,35 71.5,24.75 79.25,17 87,17 87.5,16.5 v87.5,15.25
N4_B9  (via drill 0.32)
  Top 0.254: T40.1 70.54,28.46 v70,29 | RN60.5 65.2,14.95 v65.5,15.25
  Bottom 0.254: v70,29 71,28 71,24.5 74.5,21 74.5,19 73.5,18 66,18 65.5,17.5 v65.5,15.25
N4_K0
  Top 0.406: U$7.P3 T41.3
N4_K1
  Top 0.406: U$7.P13 T42.3
N4_K2
  Top 0.406: U$7.P12 T43.3
N4_K3
  Top 0.406: U$7.P11 T46.3
N4_K4
  Top 0.406: U$7.P10 T44.3
N4_K5
  Top 0.406: U$7.P9 T45.3
N4_K6
  Top 0.406: U$7.P7 T47.3
N4_K7
  Top 0.406: U$7.P6 T48.3
N4_K8
  Top 0.406: U$7.P5 T49.3
N4_K9
  Top 0.406: U$7.P4 T40.3
N5_B0  (via drill 0.32)
  Top 0.254: RN71.6 39.4,15.15 v39.5,15.25 | T51.1 37.05,21.95 v36.5,22.5
  Bottom 0.254: 39.5,15.5 v39.5,15.25 39.5,19.75 36.75,22.5 v36.5,22.5
N5_B1  (via drill 0.32)
  Top 0.254: RN61.5 60.2,14.95 v60.5,15.25 | T52.1 59.43,19.93 v60.25,19.75
  Bottom 0.254: 60.5,15.5 v60.5,15.25 60.5,19.5 v60.25,19.75
N5_B2  (via drill 0.32)
  Top 0.254: RN61.6 59.4,15.15 v59.5,15.25 | T53.1 62.54,25.04 v62.75,25
  Bottom 0.254: v62.75,25 62.75,23.75 59.5,20.5 v59.5,15.25
N5_B3  (via drill 0.32)
  Top 0.254: RN61.7 58.6,15.15 v58.5,15.25 | T56.1 62.93,31.57 v62.75,31.25
  Bottom 0.254: 58.5,15.5 v58.5,15.25 58.5,20.25 61.75,23.5 61.75,30.25 v62.75,31.25
N5_B4  (via drill 0.32)
  Top 0.254: RN61.8 57.8,14.95 v57.5,15.25 | T54.1 60.61,37.89 v61.25,37.25
  Bottom 0.254: 57.5,15.5 v57.5,15.25 57.5,20 61.25,23.75 v61.25,37.25
N5_B5  (via drill 0.32)
  Top 0.254: RN70.5 45.2,14.95 v45.5,15.25 | T55.1 56.72,42.28 v57,42
  Bottom 0.254: 45.5,15.5 v45.5,15.25 45.5,17.5 37.5,25.5 37.5,34.5 45,42 v57,42
N5_B6  (via drill 0.32)
  Top 0.254: RN70.6 44.4,15.15 v44.5,15.25 | T57.1 44.11,43.11 v44.5,43.5
  Bottom 0.254: 44.5,15.5 v44.5,15.25 44.5,17.75 37,25.25 37,34.75 44.5,42.25 v44.5,43.5
N5_B7  (via drill 0.32)
  Top 0.254: RN70.7 43.6,15.15 v43.5,15.25 | T58.1 38.57,39.57 v39.25,40.25
  Bottom 0.254: 43.5,15.5 v43.5,15.25 43.5,18 36.5,25 36.5,35 39.25,37.75 v39.25,40.25
N5_B8  (via drill 0.32)
  Top 0.254: RN70.8 42.8,14.95 v42.5,15.25 | T59.1 35.51,35.01 v35.75,35.25
  Bottom 0.254: 42.5,15.5 v42.5,15.25 42.5,18.25 36,24.75 36,35 v35.75,35.25
N5_B9  (via drill 0.32)
  Top 0.254: RN71.5 40.2,14.95 v40.5,15.25 | T50.1 35.04,28.46 v34.5,29
  Bottom 0.254: 40.5,15.5 v40.5,15.25 40.5,19.5 35.5,24.5 35.5,27.75 34.5,28.75 v34.5,29
N5_K0
  Top 0.406: T51.3 U$8.P3
N5_K1
  Top 0.406: T52.3 U$8.P13
N5_K2
  Top 0.406: T53.3 U$8.P12
N5_K3
  Top 0.406: T56.3 U$8.P11
N5_K4
  Top 0.406: T54.3 U$8.P10
N5_K5
  Top 0.406: T55.3 U$8.P9
N5_K6
  Top 0.406: T57.3 U$8.P7
N5_K7
  Top 0.406: T58.3 U$8.P6
N5_K8
  Top 0.406: T59.3 U$8.P5
N5_K9
  Top 0.406: T50.3 U$8.P4
N6_B0  (via drill 0.32)
  Top 0.254: RN81.8 17.8,14.95 v17.5,15.25 | T61.1 6.05,21.95 v5.5,22.5
  Bottom 0.254: v17.5,15.25 17.5,15.5 17,16 12.25,16 5.75,22.5 v5.5,22.5
N6_B1  (via drill 0.32)
  Top 0.254: RN71.7 38.6,15.15 v38.5,15.25 | T62.1 28.43,19.68 v28.25,19.5
  Bottom 0.254: 38.5,15.5 v38.5,15.25 38.5,18 38,18.5 29,18.5 28.25,19.25 v28.25,19.5
N6_B2  (via drill 0.32)
  Top 0.254: RN71.8 37.8,14.95 v37.5,15.25 | T63.1 31.54,25.04 v31.5,25
  Bottom 0.254: 37.5,15.5 v37.5,15.25 37.5,17.5 37,18 27.5,18 26.75,18.75 26.75,20.75 31,25 v31.5,25
N6_B3  (via drill 0.32)
  Top 0.254: RN80.5 25.2,14.95 v25.5,15.25 | T66.1 31.93,31.57 v32,31.5
  Bottom 0.254: v32,31.5 30.75,30.25 30.75,25.5 25.5,20.25 v25.5,15.25
N6_B4  (via drill 0.32)
  Top 0.254: RN80.6 24.4,15.15 v24.5,15.25 | T64.1 29.61,37.89 v30.25,37.25
  Bottom 0.254: v30.25,37.25 30.25,25.75 24.5,20 v24.5,15.25
N6_B5  (via drill 0.32)
  Top 0.254: RN80.7 23.6,15.15 v23.5,15.25 | T65.1 25.72,42.28 v26,42
  Bottom 0.254: 23.5,15.5 v23.5,15.25 23.5,18 23,18.5 13.5,18.5 6.5,25.5 6.5,34.5 14,42 v26,42
N6_B6  (via drill 0.32)
  Top 0.254: RN80.8 22.8,14.95 v22.5,15.25 | T67.1 13.11,43.11 v13.5,43.5
  Bottom 0.254: 22.5,15.5 v22.5,15.25 22.5,17.5 22,18 13.25,18 6,25.25 6,34.75 13.5,42.25 v13.5,43.5
N6_B7  (via drill 0.32)
  Top 0.254: RN81.5 20.2,14.95 v20.5,15.25 | T68.1 7.57,39.57 v8.25,40.25
  Bottom 0.254: 20.5,15.5 v20.5,15.25 20.5,17 20,17.5 13,17.5 5.5,25 5.5,35 8.25,37.75 v8.25,40.25
N6_B8  (via drill 0.32)
  Top 0.254: RN81.6 19.4,15.15 v19.5,15.25 | T69.1 4.51,35.01 v4.75,35.25
  Bottom 0.254: 19.5,15.5 v19.5,15.25 19.5,16.5 19,17 12.75,17 5,24.75 5,35 v4.75,35.25
N6_B9  (via drill 0.32)
  Top 0.254: RN81.7 18.6,15.15 v18.5,15.25 | T60.1 4.04,28.46 v3.75,28.75
  Bottom 0.254: 18.5,15.5 v18.5,15.25 18.5,16 18,16.5 12.5,16.5 4.5,24.5 4.5,28 v3.75,28.75
N6_K0
  Top 0.406: T61.3 U$9.P3
N6_K1
  Top 0.406: T62.3 U$9.P13
N6_K2
  Top 0.406: T63.3 U$9.P12
N6_K3
  Top 0.406: T66.3 U$9.P11
N6_K4
  Top 0.406: T64.3 U$9.P10
N6_K5
  Top 0.406: T65.3 U$9.P9
N6_K6
  Top 0.406: T67.3 U$9.P7
N6_K7
  Top 0.406: T68.3 U$9.P6
N6_K8
  Top 0.406: T69.3 U$9.P5
N6_K9
  Top 0.406: T60.3 U$9.P4
N$1
  Top 0.305: R2.1 132,21.5 131.5,22 131.5,26 132.5,27 132.5,34.23 GL2.1
N$2
  Top 0.305: R3.1 68,21.73 GL3.1
N$3
  Top 0.305: R4.1 66,21.5 65.5,22 65.5,26 66.5,27 66.5,34.23 GL4.1
N$4
  Top 0.406: R10.1 178.5,22.5 U$4.P2
N$5
  Top 0.305: T2.3 131.25,39.02 GL2.2
N$6
  Top 0.305: T1.3 134.75,34.25 133.5,33 133.5,25.77 GL1.2
N$7
  Top 0.305: T4.3 65.25,39.02 GL4.2
N$8
  Top 0.305: T3.3 68.75,34.25 67.5,33 67.5,25.77 GL3.2
N$9
  Top 0.406: R20.1 146.5,22.39 U$5.P2
N$10  (via drill 0.4)
  Top 0.254: IC1.9 175.56,6.05 v176,6.5 | v162.5,6.5 161.91,5.91 IC2.14
  Bottom 0.254: v176,6.5 175.5,7 163,7 v162.5,6.5
N$11  (via drill 0.4)
  Top 0.254: IC2.9 155.56,6.05 v156,6.5 | v142.5,6.5 141.91,5.91 IC3.14
  Bottom 0.254: v156,6.5 155.5,7 143,7 v142.5,6.5
N$12  (via drill 0.4)
  Top 0.254: IC3.9 135.56,6.05 v136,6.5 | v112.5,6.5 111.91,5.91 IC4.14
  Bottom 0.254: v136,6.5 135.5,7 113,7 v112.5,6.5
N$13
  Top 0.406: R30.1 112.5,22.39 U$6.P2
N$14
  Top 0.406: R40.1 81,22.39 U$7.P2
N$15
  Top 0.406: R50.1 45.5,22.39 U$8.P2
N$16  (via drill 0.4)
  Top 0.254: IC4.9 105.56,6.05 v106,6.5 | v92.5,6.5 91.91,5.91 IC5.14
  Bottom 0.254: v106,6.5 105.5,7 93,7 v92.5,6.5
N$17
  Top 0.406: R60.1 14.5,22.39 U$9.P2
N$18  (via drill 0.4)
  Top 0.254: IC5.9 85.56,6.05 v86,6.5 | v62.5,6.5 61.91,5.91 IC6.14
  Bottom 0.254: v86,6.5 85.5,7 79,7 78,6 71,6 70,7 63,7 v62.5,6.5
N$19  (via drill 0.4)
  Top 0.254: IC6.9 55.55,6.05 v56,6.5 | IC7.14 41.91,5.91 v42.5,6.5
  Bottom 0.254: v56,6.5 55.5,7 43,7 v42.5,6.5
N$20  (via drill 0.4)
  Top 0.254: IC7.9 35.55,6.05 v36,6.5 | v22.5,6.5 21.91,5.91 IC8.14
  Bottom 0.254: v36,6.5 35.5,7 23,7 v22.5,6.5
N$21
  Top 0.305: R1.1 134,21.73 GL1.1
RCK  (via drill 0.4)
  Top 0.254: IC1.12 179.37,7.63 v179,8 | IC2.12 159.37,7.63 v159,8 | IC3.12 139.37,7.63 v139,8 | IC4.12 109.36,7.63 v109,8 | IC5.12 89.36,7.63 v89,8 | v72.5,8 72.5,10 JP1.5 | IC6.12 59.37,7.63 v59,8 | IC7.12 39.37,7.63 v39,8 | IC8.12 19.36,7.63 v19,8
  Bottom 0.254: v179,8 178.5,8.5 161,8.5 160.5,8 v159,8 158.5,8.5 141,8.5 140.5,8 v139,8 138.5,8.5 111,8.5 110.5,8 v109,8 108.5,8.5 91,8.5 90.5,8 v89,8 88.5,8.5 72.5,8.5 | 72.5,8.5 v72.5,8 | 72.5,8.5 61,8.5 60.5,8 v59,8 58.5,8.5 41,8.5 40.5,8 v39,8 38.5,8.5 21,8.5 20.5,8 v19,8
SCK  (via drill 0.4)
  Top 0.254: IC1.11 178.09,7.41 v178,7.5 | IC2.11 158.09,7.41 v158,7.5 | IC3.11 138.09,7.41 v138,7.5 | IC4.11 108.09,7.41 v108,7.5 | IC5.11 88.09,7.41 v88,7.5 | v75,7.5 JP1.3 | IC6.11 58.09,7.41 v58,7.5 | IC7.11 38.09,7.41 v38,7.5 | IC8.11 18.09,7.41 v18,7.5
  Bottom 0.254: v178,7.5 177.5,8 161.5,8 160.5,7 158.5,7 v158,7.5 157.5,8 141.5,8 140.5,7 138.5,7 v138,7.5 137.5,8 111.5,8 110.5,7 108.5,7 v108,7.5 107.5,8 91.5,8 90.5,7 88.5,7 v88,7.5 87.5,8 75.5,8 v75,7.5 74.5,7 72,7 71,8 61.5,8 60.5,7 58.5,7 v58,7.5 57.5,8 41.5,8 40.5,7 38.5,7 v38,7.5 37.5,8 21.5,8 20.5,7 18.5,7 v18,7.5
SCL  (via drill 0.4)
  Top 0.254: IC1.10 176.82,6.83 v177,7 | IC2.10 156.82,6.83 v157,7 | IC3.10 136.82,6.83 v137,7 | IC4.10 106.83,6.83 v107,7 | IC5.10 86.83,6.83 v87,7 | v77.5,7 77.5,5 JP1.2 | IC6.10 56.83,6.83 v57,7 | IC7.10 36.83,6.83 v37,7 | IC8.10 16.82,6.83 v17,7
  Bottom 0.254: v177,7 176.5,7.5 162,7.5 161,6.5 157.5,6.5 v157,7 156.5,7.5 142,7.5 141,6.5 137.5,6.5 v137,7 136.5,7.5 112,7.5 111,6.5 107.5,6.5 v107,7 106.5,7.5 92,7.5 91,6.5 87.5,6.5 v87,7 86.5,7.5 78,7.5 v77.5,7 77,6.5 71.5,6.5 70.5,7.5 62,7.5 61,6.5 57.5,6.5 v57,7 56.5,7.5 42,7.5 41,6.5 37.5,6.5 v37,7 36.5,7.5 22,7.5 21,6.5 17.5,6.5 v17,7
VDD
  Top 0.305: R1.2 134,16.25 | R2.2 132,16.25 | R4.2 66,16.25 | R3.2 68,16.25
  Top 0.406: 146.5,16.25 177.75,16.25 178.5,17 R10.2 | 146.5,16.25 134,16.25 132,16.25 127.5,16.25 | 127.5,16.25 112.5,16.25 | 112.5,16.25 81,16.25 | JP2.1 127.54,16.21 127.5,16.25 | R60.2 14.59,16.91 15.25,16.25 45.5,16.25 | 45.5,16.25 66,16.25 68,16.25 81,16.25 | R50.2 45.5,16.25 | R40.2 81,16.25 | R30.2 112.5,16.25 | R20.2 146.5,16.25